# Altium project TX_v5.PrjPcb
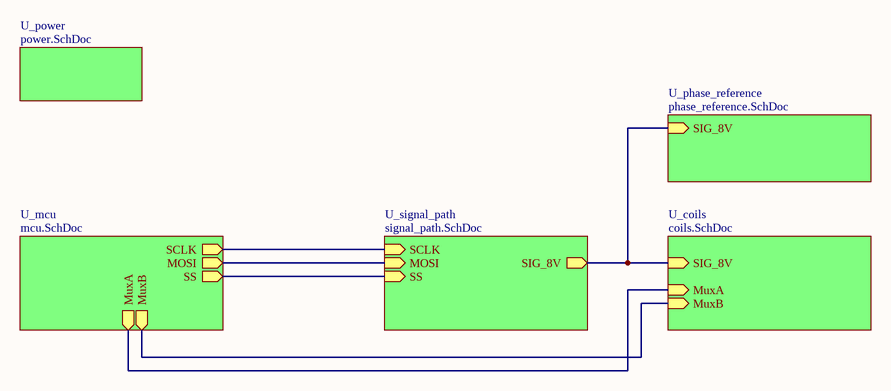
[diagram p0: TX_v5.SchDoc]
7 sheets, 94 parts. Net scope: hierarchical (ports join the sheet entries above them; power ports are global).
Board file: TX_v5.PcbDoc
Sheets:
  TX_v5.SchDoc
    U_power = power.SchDoc
    U_mcu = mcu.SchDoc
    U_signal_path = signal_path.SchDoc
    U_coils = coils.SchDoc
      ch1 = coil.SchDoc
      ch2 = coil.SchDoc
      ch3 = coil.SchDoc
    U_phase_reference = phase_reference.SchDoc

## Sheet TX_v5.SchDoc
size A

### Sub-sheets
U_coils = coils.SchDoc: MuxA (in), MuxB (in), SIG_8V (in)
U_mcu = mcu.SchDoc: SCLK (out), MuxB (out), MuxA (out), MOSI (out), SS (out)
U_phase_reference = phase_reference.SchDoc: SIG_8V (in)
U_power = power.SchDoc: no entries
U_signal_path = signal_path.SchDoc: SCLK (in), MOSI (in), SS (in), SIG_8V (out)

### Nets
MOSI: sheet U_mcu/MOSI, sheet U_signal_path/MOSI
MuxA: sheet U_mcu/MuxA, sheet U_coils/MuxA
MuxB: sheet U_mcu/MuxB, sheet U_coils/MuxB
SCLK: sheet U_mcu/SCLK, sheet U_signal_path/SCLK
SIG_8V: sheet U_signal_path/SIG_8V, sheet U_coils/SIG_8V, sheet U_phase_reference/SIG_8V
SS: sheet U_mcu/SS, sheet U_signal_path/SS

## Sheet power.SchDoc
size A
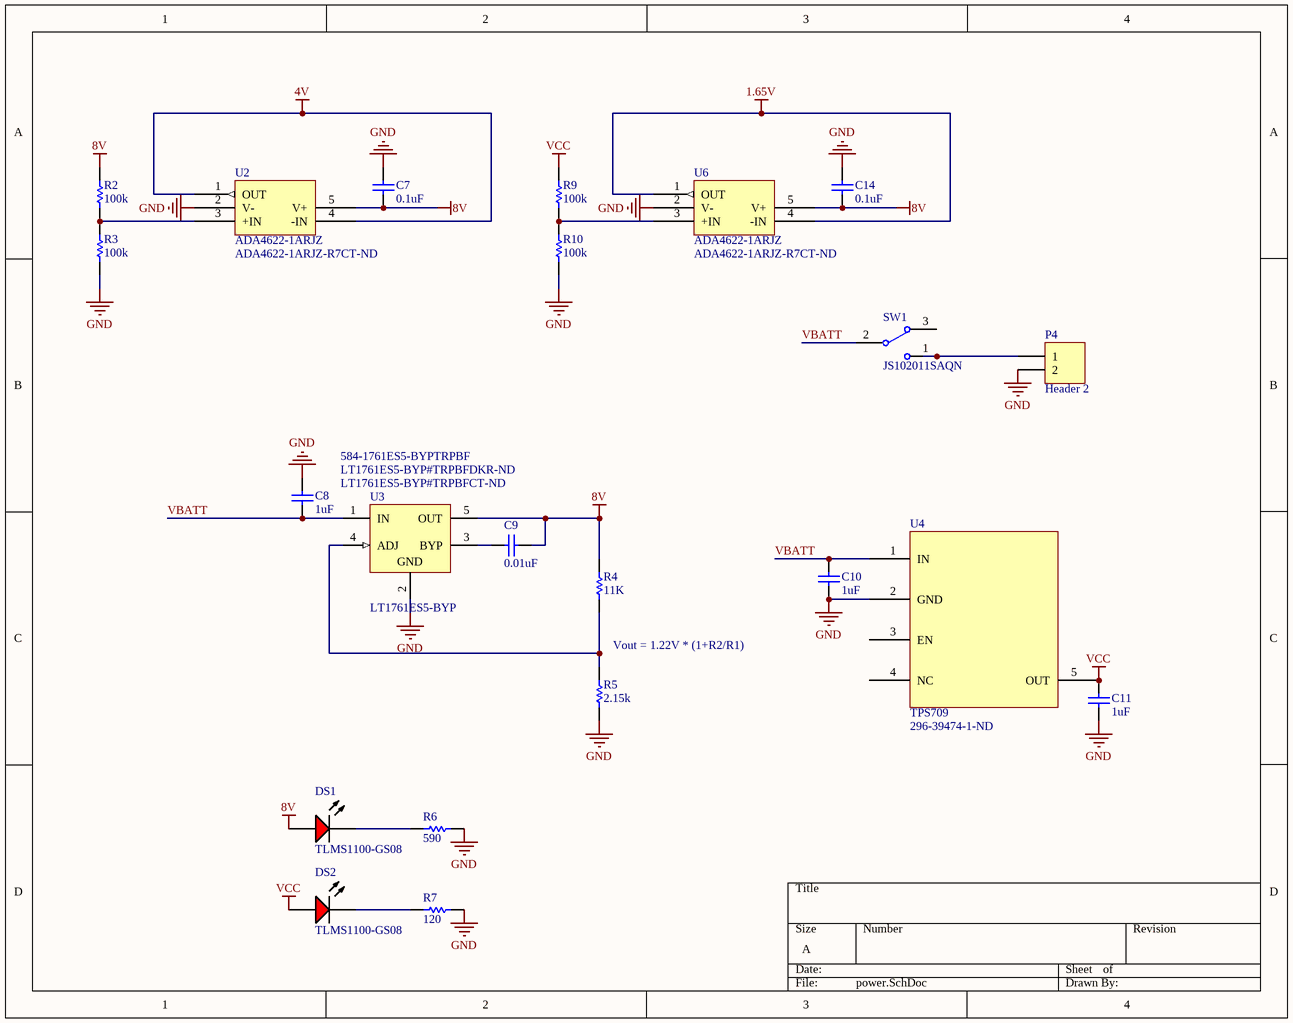
[diagram p1: power.SchDoc]

### Parts
C7  value 0.1uF  [0603]  (hidden comment: Cap)
C8  value 1uF  [0603]  (hidden comment: Cap)
C9  value 0.01uF  [0603]  (hidden comment: Cap)
C10  value 1uF  [0603]  (hidden comment: Cap)
C11  value 1uF  [0603]  (hidden comment: Cap)
C14  value 0.1uF  [0603]  (hidden comment: Cap)
DS1  TLMS1100-GS08  [VISH-TLMX1100_V]
DS2  TLMS1100-GS08  [VISH-TLMX1100_V]
P4  Header 2  [HDR1X2]
R2  value 100k  [0603]  (hidden comment: Res)
R3  value 100k  [0603]  (hidden comment: Res)
R4  value 11K  [0603]  (hidden comment: Res)
R5  value 2.15k  [0603]  (hidden comment: Res)
R6  value 590  [0603]  (hidden comment: Res)
R7  value 120  [0603]  (hidden comment: Res)
R9  value 100k  [0603]  (hidden comment: Res)
R10  value 100k  [0603]  (hidden comment: Res)
SW1  JS102011SAQN  [CKCP-JS102011SAQN-3_V]
U2  ADA4622-1ARJZ  Supplier Part Number 1: ADA4622-1ARJZ-R7CT-ND  [SOT95P280X145-5N]
U3  LT1761ES5-BYP  Supplier Part Number 1: LT1761ES5-BYP#TRPBFCT-ND  Supplier Part Number 2: LT1761ES5-BYP#TRPBFDKR-ND  Supplier Part Number 3: 584-1761ES5-BYPTRPBF  [LT-S5-5-TSOT-23_N]
U4  TPS709  Supplier Part Number 1: 296-39474-1-ND  [SOT95P280X145-5N]
U6  ADA4622-1ARJZ  Supplier Part Number 1: ADA4622-1ARJZ-R7CT-ND  [SOT95P280X145-5N]

### Nets
1.65V: U6.1(OUT) U6.4(-IN)
4V: U2.1(OUT) U2.4(-IN)
8V: C7.1 C9.1 C14.1 DS1.1(A) R2.2 R4.2 U2.5(V+) U3.5(OUT) U6.5(V+)
GND: C7.2 C8.2 C10.2 C11.2 C14.2 P4.2 R3.1 R5.1 R6.1 R7.1 R10.1 U2.2(V-) U3.2(GND) U4.2(GND) U6.2(V-)
VCC: C11.1 DS2.1(A) R9.2 U4.5(OUT)
VBATT: C8.1 C10.1 SW1.2 U3.1(IN) U4.1(IN)
NetC9_2: C9.2 U3.3(BYP)
NetDS1_2: DS1.2(K) R6.2
NetDS2_2: DS2.2(K) R7.2
NetP4_1: P4.1 SW1.1
NetR2_1: R2.1 R3.2 U2.3(+IN)
NetR4_1: R4.1 R5.2 U3.4(ADJ)
NetR9_1: R9.1 R10.2 U6.3(+IN)

Not connected (* = marked no-connect by the designer): SW1 3; U4 3(EN) 4(NC)

### Notes on the sheet
- Vout = 1.22V * (1+R2/R1)

### Library data of the parts
C7-C11 C14 = Cap: Ceramic Capacitor (Surface Mount); Manufacturer: Generic Ceramic Chip Cap (TBD); Digi-Key Part Number: *; Manufacturer Part Number: *; Note: *; Rating: *
DS1 DS2 = CMP-1666-00027-1: LED, RED, 2.1 V, -40 to 100 degC, 2-Pin SMD (0603), RoHS, Tape and Reel; Type (Capacitors): C0G; Resistance: 100000000000 Ohm; Capacitance: 12 pF; Voltage Rating: 50 V; Tolerance: 5%; Min Operating Temperature: -55degC; REACH SVHC: No SVHC; ComponentLink2Description: Datasheet; ComponentLink1URL: http://www.vishay.com/; Width: 0.8 mm; Package Quantity: 4000; PackageReference: TLMX1100; ComponentLink2URL: http://www.vishay.com/docs/83173/tlmb1100.pdf; Case/Package: 0603; Case Code (Metric): 1608; Packaging: Tape and Reel; Pins: 2; ComponentLink1Description: Manufacturer URL; Max Operating Temperature: 125degC; Height: 0.8 mm; Length: 1.6 mm; Mount: Surface Mount; PackageDescription: 2-Pin Surface Mount Device, Body 1.6 x 0.8 mm; DatasheetVersion: Rev. 2.7, 03/2016; Case Code (Imperial): 0603; Voltage Rating (DC): 50 V; RoHSCompliant: True; Radiation Hardening: No
P4 = Header 2: Header, 2-Pin; LatestRevisionDate: 17-Jul-2002; LatestRevisionNote: Re-released for DXP Platform.; Publisher: Altium Limited
R2-R7 R9 R10 = Res: Chip Resistor (Surface Mount); Manufacturer: Generic Chip Res (TBD); Manufacturer Part Number: *; Digi-Key Part Number: *; Rating: *
SW1 = CMP-2000-06501-1: Sub-Miniature Slide Switch, SPDT, -40 to 85 degC, 3-Pin SMD, RoHS, Tape and Reel; Manufacturer: C&K Components; Electrical Life: 15000Cycles; Actuator Color: Black; Body Orientation: RightAngle; Minimum Insulation Resistance: 100MOhm; Contact Rating @ Voltage: 0.3@6VDCA; Actuator Style: SideSlide; Maximum DC Voltage Rating: 6V; COO: US; Actuator Material: Nylon4/6; Dielectric Strength: 500VAC; Maximum Contact Resistance: 70mOhm; Base Material: N/A; Mounting Technology: SurfaceMount; Switch Configuration: N/A; Package Reference: SMT; Package Description: 3-Pin Surface Mount Device, Body 9 x 3.6 mm, Height 3.5 mm; Mounting: SurfaceMount,GullWing; Part No: JS102011SAQN; Dimension: 9x4.3mm; Type: Sub-Miniature; Product Weight: N/A; Seal Location: N/A; Family: JS; ECCN: EAR99; Supplier: C&KComponents; Seal Description: N/A; Contact Plating: Silver; Pole Throw Configuration: SPDT; Packaging: TapeandReel; Manufacturer URL: http://www.ckswitches.com/; Datasheet URL: https://datasheet.ciiva.com/1532/js-9dec14-1532400.pdf; Maximum AC Voltage Rating: N/A; Mechanical Life: N/A; HTS: 8536509050; Datasheet Version: 12/2014; Housing Material: Nylon4/6; Contact Material: CopperAlloy; RoHS: Yes; Operating Temperature: -40to85C
U2 U6 = ADA4622-1ARJZ: 30 V, 8 MHz, Low Bias Current, / Single-Supply, RRO, Precision Op Amps; ComponentLink1Description: Datasheet; ComponentLink1URL: http://www.analog.com/media/en/technical-documentation/data-sheets/ada4622-1-4622-2-4622-4.pdf; Supplier 1: Digi-Key
U3 = CMP-0476-01245-1: 100 mA, Low Noise, LDO Micropower Regulator, 1.8 to 20 V Vin, Adjustable Vout, 5-pin SOT23 (S5-5), -40 to 125 degC; Manufacturer: Linear Technology; Vout Max(V): 20; Isupply(mA): 0.02; PSRR(dB): 65; Vout Min(V): 1.22; Iout(mA): 100; Shutdown Current(uA): 1; Discrete Pass Element: no; Vin Min(V): 1.8; Output Voltage: Adj; Dropout Voltage(V): 0.3; PackageDescription: 5-Pin Plastic TSOT-23, Body 1.63 x 2.90 mm, Pitch 0.95 mm; ComponentLink2URL: http://cds.linear.com/docs/en/datasheet/1761sff.pdf; Code_JEDEC: MO-193; DatasheetVersion: Rev. F; Mounting Technology: Surface Mount; PackageReference: S5-5; ComponentLink3Description: Package Specification; ComponentLink2Description: Datasheet; ComponentLink1Description: Manufacturer URL; RoHS: FALSE; Number of Outputs: 1; Noise(uV): 20; Vin Max(V): 20; ComponentLink1URL: http://www.linear.com/; PackageVersion: Jun-10; ComponentLink3URL: http://cds.linear.com/docs/en/packaging/SOT_5_05-08-1635.pdf; PartNumber: LT1761ES5-BYP; Supplier 1: Digi-Key; Supplier 2: Digi-Key; Supplier 3: Mouser
U4 = TPS70933: 3.3V Ultra low power Voltage Regulator; Supplier 1: Digi-Key

## Sheet mcu.SchDoc
size A
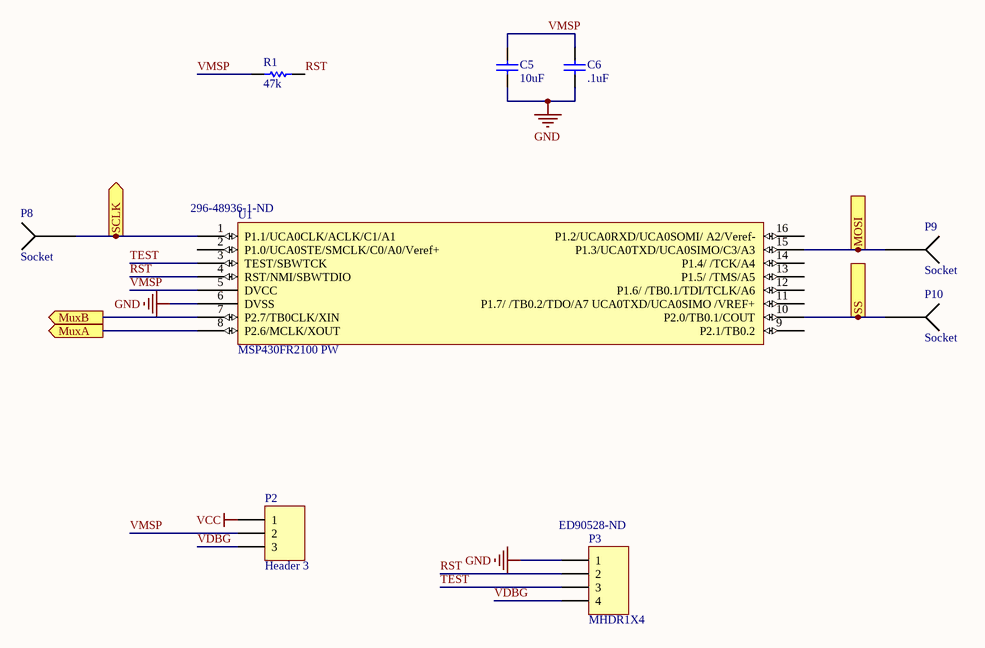
[diagram p2: mcu.SchDoc]

### Parts
C5  value 10uF  [0603]  (hidden comment: Cap)
C6  value .1uF  [0603]  (hidden comment: Cap)
P2  Header 3  [HDR1X3]
P3  MHDR1X4  Supplier Part Number 1: ED90528-ND  [MHDR1X4]
P8  Socket  [socket]
P9  Socket  [socket]
P10  Socket  [socket]
R1  value 47k  [0603]  (hidden comment: Res)
U1  MSP430FR2100 PW  Supplier Part Number 1: 296-48936-1-ND  [TSOP65P640X120-16N]

### Ports
MOSI (out), MuxA (out), MuxB (out), SCLK (out), SS (out)

### Nets
GND: C5.1 C6.1 P3.1 U1.6(DVSS)
VCC: P2.1
MOSI: P9.0 U1.15(P1.3/UCA0TXD/UCA0SIMO/C3/A3) ; port MOSI
MuxA: U1.8(P2.6/MCLK/XOUT) ; port MuxA
MuxB: U1.7(P2.7/TB0CLK/XIN) ; port MuxB
RST: P3.2 R1.2 U1.4(RST/NMI/SBWTDIO)
SCLK: P8.0 U1.1(P1.1/UCA0CLK/ACLK/C1/A1) ; port SCLK
SS: P10.0 U1.10(P2.0/TB0.1/COUT) ; port SS
TEST: P3.3 U1.3(TEST/SBWTCK)
VDBG: P2.3 P3.4
VMSP: C5.2 C6.2 P2.2 R1.1 U1.5(DVCC)

Not connected (* = marked no-connect by the designer): U1 2(P1.0/UCA0STE/SMCLK/C0/A0/Veref+) 9(P2.1/TB0.2) 11(P1.7/_/TB0.2/TDO/A7_UCA0TXD/UCA0SIMO_/VREF+) 12(P1.6/_/TB0.1/TDI/TCLK/A6) 13(P1.5/_/TMS/A5) 14(P1.4/_/TCK/A4) 16(P1.2/UCA0RXD/UCA0SOMI/_A2/Veref-)

### Library data of the parts
C5 C6 = Cap: as C7 on sheet power; Digi-Key Part Number: *; Manufacturer Part Number: *; Note: *; Rating: *
P2 = Header 3: Header, 3-Pin; LatestRevisionDate: 17-Jul-2002; LatestRevisionNote: Re-released for DXP Platform.; Publisher: Altium Limited
P3 = MHDR1X4: Header, 4-Pin; LatestRevisionDate: 17-Jul-2002; LatestRevisionNote: Re-released for DXP Platform.; Publisher: Altium Limited; Supplier 1: Digi-Key
R1 = Res: as R2 on sheet power; Manufacturer Part Number: *; Digi-Key Part Number: *; Rating: *
U1 = MSP430FR2100 PW: ComponentLink1Description: Datasheet; ComponentLink1URL: http://www.ti.com/lit/ds/symlink/msp430fr2100.pdf; ComponentLink2Description: DigiKey; ComponentLink2URL: https://www.digikey.com/product-detail/en/texas-instruments/MSP430FR2100IPW16R/296-48936-1-ND/8634999; Supplier 1: Digi-Key

## Sheet signal_path.SchDoc: Signal Path
size A
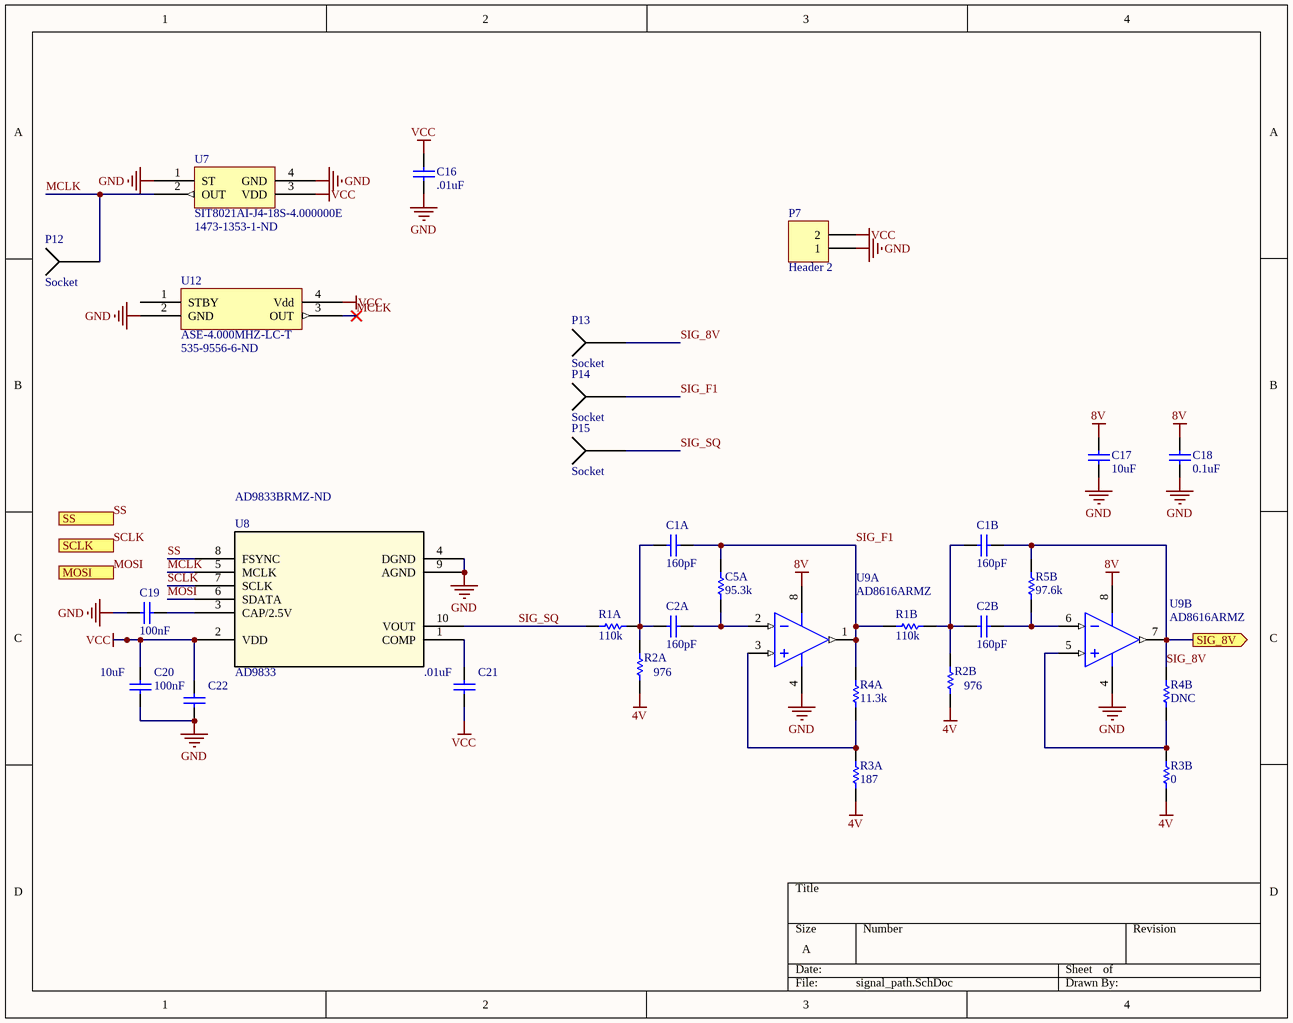
[diagram p3: signal_path.SchDoc]

### Parts
C1A  value 160pF  [0603]  (hidden comment: Cap)
C1B  value 160pF  [0603]  (hidden comment: Cap)
C2A  value 160pF  [0603]  (hidden comment: Cap)
C2B  value 160pF  [0603]  (hidden comment: Cap)
C5A  value 95.3k  [0603]  (hidden comment: Res)
C16  value .01uF  [0603]  (hidden comment: Cap)
C17  value 10uF  [0603]  (hidden comment: Cap)
C18  value 0.1uF  [0603]  (hidden comment: Cap)
C19  value 100nF  [0603]  (hidden comment: Cap)
C20  value 10uF  [0603]  (hidden comment: Cap)
C21  value .01uF  [0603]  (hidden comment: Cap)
C22  value 100nF  [0603]  (hidden comment: Cap)
P7  Header 2  [HDR1X2]
P12  Socket  [socket]
P13  Socket  [socket]
P14  Socket  [socket]
P15  Socket  [socket]
R1A  value 110k  [0603]  (hidden comment: Res)
R1B  value 110k  [0603]  (hidden comment: Res)
R2A  value 976  [0603]  (hidden comment: Res)
R2B  value 976  [0603]  (hidden comment: Res)
R3A  value 187  [0603]  (hidden comment: Res)
R3B  value 0  [0603]  (hidden comment: Res)
R4A  value 11.3k  [0603]  (hidden comment: Res)
R4B  value DNC  [0603]  (hidden comment: Res)
R5B  value 97.6k  [0603]  (hidden comment: Res)
U7  SIT8021AI-J4-18S-4.000000E  Supplier Part Number 1: 1473-1353-1-ND  [SiT8021 - BGA4C100P2X2_154X84X60]
U8  AD9833  Supplier Part Number 1: AD9833BRMZ-ND  [MSOP-10]
U9  AD8616ARMZ  [ADI-RM-8_M]  (parts A,B of 2)
U12  ASE-4.000MHZ-LC-T  Supplier Part Number 1: 535-9556-6-ND  [DFN165P250X120-4N]

### Ports
MOSI (in), SCLK (in), SIG_8V (out), SS (in)

### Nets
4V: R2A.1 R2B.1 R3A.1 R3B.1
8V: C17.1 C18.1 U9.8(+V)
GND: C16.2 C17.2 C18.2 C19.1 C20.2 C22.2 P7.1 U7.1(ST) U7.4(GND) U8.4(DGND) U8.9(AGND) U9.4(-V) U12.2(GND)
VCC: C16.1 C20.1 C21.2 C22.1 P7.2 U7.3(VDD) U8.2(VDD) U12.4(Vdd)
MCLK: P12.0 U7.2(OUT) U8.5(MCLK) U12.3(OUT)
MOSI: U8.6(SDATA) ; port MOSI
SCLK: U8.7(SCLK) ; port SCLK
SIG_8V: C1B.2 P13.0 R4B.2 R5B.2 U9.7(OUT_B) ; port SIG_8V
SIG_F1: C1A.2 C5A.2 P14.0 R1B.1 R4A.2 U9.1(OUT_A)
SIG_SQ: P15.0 R1A.1 U8.10(VOUT)
SS: U8.8(FSYNC) ; port SS
NetC1A_1: C1A.1 C2A.1 R1A.2 R2A.2
NetC1B_1: C1B.1 C2B.1 R1B.2 R2B.2
NetC2A_2: C2A.2 C5A.1 U9.2(-IN_A)
NetC2B_2: C2B.2 R5B.1 U9.6(-IN_B)
NetC19_2: C19.2 U8.3(CAP/2.5V)
NetC21_1: C21.1 U8.1(COMP)
NetR3A_2: R3A.2 R4A.1 U9.3(+IN_A)
NetR3B_2: R3B.2 R4B.1 U9.5(+IN_B)

Not connected (* = marked no-connect by the designer): U12 1(STBY)

### Library data of the parts
C1A C1B C2A C2B C16-C22 = Cap: as C7 on sheet power; Digi-Key Part Number: *; Manufacturer Part Number: *; Note: *; Rating: *
C5A R1A R1B R2A R2B R3A R3B R4A R4B R5B = Res: as R2 on sheet power; Manufacturer Part Number: *; Digi-Key Part Number: *; Rating: *
P7 = Header 2: Header, 2-Pin; LatestRevisionDate: 17-Jul-2002; LatestRevisionNote: Re-released for DXP Platform.; Publisher: Altium Limited
U7 = SIT8021AI-J4-18S-4.000000E: 4 MHz low power oscillator; Supplier 1: Digi-Key
U8 = AD9833: MSOP-10; Supplier 1: Digi-Key
U9 = CMP-0384-01709-1: Double Channel Wide Bandwidth Operational Amplifier, 24 MHz BW, 12 V/us SR, Industrial, 8-pin SOP (RM-8), Tube; Generic Part Number: AD8616; Manufacturer: Analog Devices; Amplifiers Per Package: 2; Small Signal Bandwidth: 24MHz; Input Offset Voltage: 23uV; Input Bias Current: 200fA; V Span Min: 2.7V; Iq/Amp: 2mA; Slew Rate: 12V/us; V Span Max: 6V; PackageDescription: 8-Pin Mini Small Outline Package, Body 3 x 3 mm, Pitch 0.65 mm; PartNumber: AD8616ARMZ; ComponentLink2URL: http://www.analog.com/static/imported-files/data_sheets/AD8615_8616_8618.pdf; ComponentLink3URL: http://www.analog.com/static/imported-files/packages/PKG_PDF/MSOP%28RM%29/RM_8.pdf; PackageReference: RM-8; Mounting Technology: Surface Mount; Code_JEDEC: MO-187-AA; ComponentLink1Description: Manufacturer URL; ComponentLink2Description: Datasheet; ComponentLink3Description: Package Specification; ComponentLink1URL: http://www.analog.com/en/index.html; DatasheetVersion: Rev. E; PartId: 1
U12 = ASE-4.000MHZ-LC-T: 4 MHz SMD Oscillator; Supplier 1: Digi-Key

## Sheet coils.SchDoc
size A
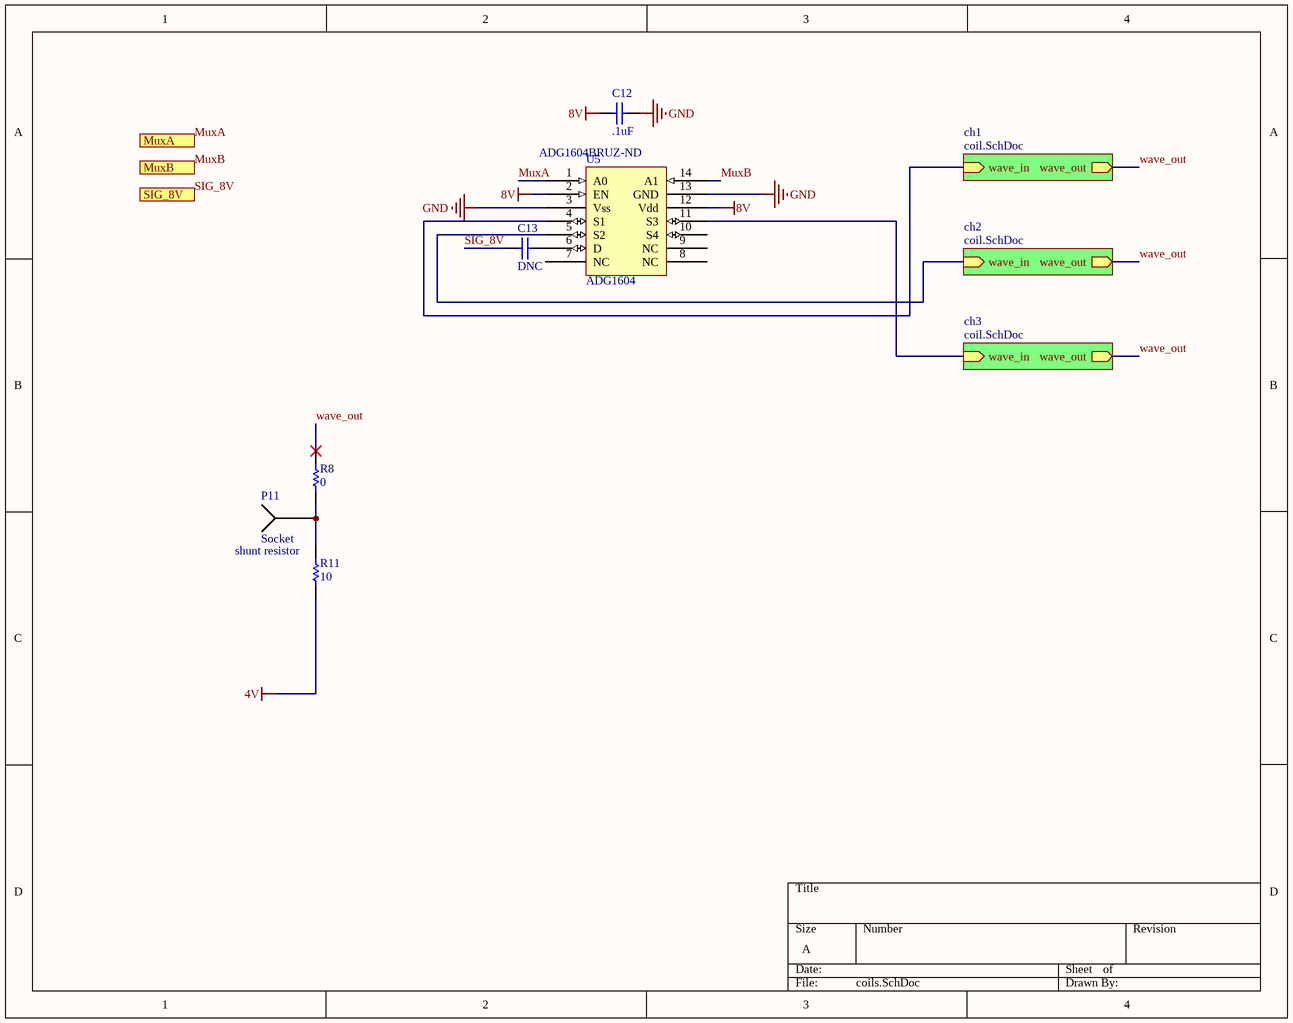
[diagram p4: coils.SchDoc]

### Parts
C12  value .1uF  [0603]  (hidden comment: Cap)
C13  value DNC  [0603]  (hidden comment: Cap)
P11  Socket  [socket]
R8  value 0  [0603]  (hidden comment: Res)
R11  value 10  [0603]  (hidden comment: Res)
U5  ADG1604  Supplier Part Number 1: ADG1604BRUZ-ND  [TSSOP-14]

### Sub-sheets
ch1 = coil.SchDoc: wave_in (in), wave_out (out)
ch2 = coil.SchDoc: wave_in (in), wave_out (out)
ch3 = coil.SchDoc: wave_in (in), wave_out (out)

### Ports
MuxA (in), MuxB (in), SIG_8V (in)

### Nets
4V: R11.1
8V: C12.1 U5.2(EN) U5.12(Vdd)
GND: C12.2 U5.3(Vss) U5.13(GND)
MuxA: U5.1(A0) ; port MuxA
MuxB: U5.14(A1) ; port MuxB
SIG_8V: C13.1 ; port SIG_8V
wave_out: R8.2 ; sheet ch1/wave_out, sheet ch2/wave_out, sheet ch3/wave_out
NetC1_ch1_2: U5.4(S1) ; sheet ch1/wave_in
NetC1_ch2_2: U5.5(S2) ; sheet ch2/wave_in
NetC1_ch3_2: U5.11(S3) ; sheet ch3/wave_in
NetC13_2: C13.2 U5.6(D)
NetP11_0: P11.0 R8.1 R11.2

Not connected (* = marked no-connect by the designer): U5 7(NC) 8(NC) 9(NC) 10(S4)

### Notes on the sheet
- (near R11) shunt resistor

### Library data of the parts
C12 C13 = Cap: as C7 on sheet power; Digi-Key Part Number: *; Manufacturer Part Number: *; Note: *; Rating: *
R8 R11 = Res: as R2 on sheet power; Manufacturer Part Number: *; Digi-Key Part Number: *; Rating: *
U5 = ADG1604: Supplier 1: Digi-Key

## Sheet coil.SchDoc
size A
Used 3 times, as channels U_coils/ch1, U_coils/ch2, U_coils/ch3. Parts and nets are listed once, with the designators drawn on the sheet.
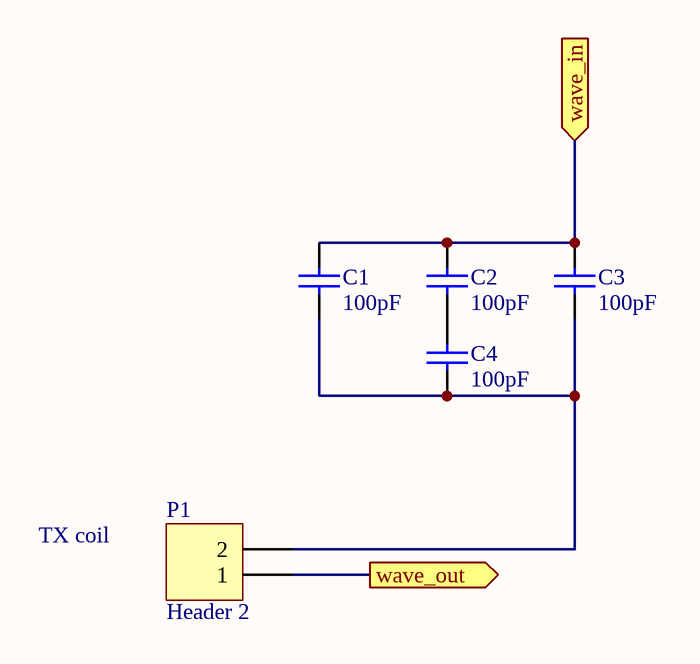
[diagram p5: coil.SchDoc]

### Parts
C1  value 100pF  [0603]  (hidden comment: Cap)
C2  value 100pF  [0603]  (hidden comment: Cap)
C3  value 100pF  [0603]  (hidden comment: Cap)
C4  value 100pF  [0603]  (hidden comment: Cap)
P1  Header 2  [HDR1X2]

### Ports
wave_in (in), wave_out (out)

### Nets
wave_in: C1.2 C2.2 C3.2 ; port wave_in
wave_out: P1.1 ; port wave_out
NetC1_1: C1.1 C3.1 C4.1 P1.2
NetC2_1: C2.1 C4.2

### Channels
U_coils/ch1: designators end in _ch1; ports wave_in=NetC1_ch1_2 wave_out=wave_out
U_coils/ch2: designators end in _ch2; ports wave_in=NetC1_ch2_2 wave_out=wave_out
U_coils/ch3: designators end in _ch3; ports wave_in=NetC1_ch3_2 wave_out=wave_out

### Notes on the sheet
- TX coil

### Library data of the parts
C1-C4 = Cap: as C7 on sheet power; Digi-Key Part Number: *; Manufacturer Part Number: *; Note: *; Rating: *
P1 = Header 2: Header, 2-Pin; LatestRevisionDate: 17-Jul-2002; LatestRevisionNote: Re-released for DXP Platform.; Publisher: Altium Limited

## Sheet phase_reference.SchDoc
size A
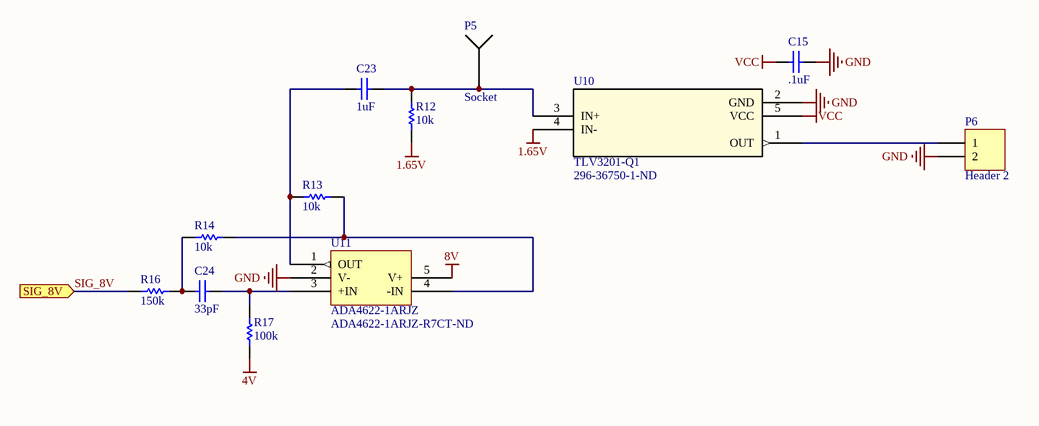
[diagram p6: phase_reference.SchDoc]

### Parts
C15  value .1uF  [0603]  (hidden comment: Cap)
C23  value 1uF  [0603]  (hidden comment: Cap)
C24  value 33pF  [0603]  (hidden comment: Cap)
P5  Socket  [socket]
P6  Header 2  [HDR1X2]
R12  value 10k  [0603]  (hidden comment: Res)
R13  value 10k  [0603]  (hidden comment: Res)
R14  value 10k  [0603]  (hidden comment: Res)
R16  value 150k  [0603]  (hidden comment: Res)
R17  value 100k  [0603]  (hidden comment: Res)
U10  TLV3201-Q1  Supplier Part Number 1: 296-36750-1-ND  [SOT95P280X145-5N]
U11  ADA4622-1ARJZ  Supplier Part Number 1: ADA4622-1ARJZ-R7CT-ND  [SOT95P280X145-5N]

### Ports
SIG_8V (in)

### Nets
1.65V: R12.1 U10.4(IN-)
4V: R17.1
8V: U11.5(V+)
GND: C15.2 P6.2 U10.2(GND) U11.2(V-)
VCC: C15.1 U10.5(VCC)
SIG_8V: R16.2 ; port SIG_8V
NetC23_1: C23.1 P5.0 R12.2 U10.3(IN+)
NetC23_2: C23.2 R13.2 U11.1(OUT)
NetC24_1: C24.1 R17.2 U11.3(+IN)
NetC24_2: C24.2 R14.2 R16.1
NetP6_1: P6.1 U10.1(OUT)
NetR13_1: R13.1 R14.1 U11.4(-IN)

### Library data of the parts
C15 C23 C24 = Cap: as C7 on sheet power; Digi-Key Part Number: *; Manufacturer Part Number: *; Note: *; Rating: *
P6 = Header 2: Header, 2-Pin; LatestRevisionDate: 17-Jul-2002; LatestRevisionNote: Re-released for DXP Platform.; Publisher: Altium Limited
R12-R14 R16 R17 = Res: as R2 on sheet power; Manufacturer Part Number: *; Digi-Key Part Number: *; Rating: *
U10 = TLV3201-Q1: 40-ns, Micropower Comparator; Supplier 1: Digi-Key
U11 = ADA4622-1ARJZ: as U2 on sheet power; ComponentLink1Description: Datasheet; ComponentLink1URL: http://www.analog.com/media/en/technical-documentation/data-sheets/ada4622-1-4622-2-4622-4.pdf; Supplier 1: Digi-Key

## Nets that join several sheets
1.65V: power (U6.1 U6.4), phase_reference (R12.1 U10.4)
4V: power (U2.1 U2.4), signal_path (R2A.1 R2B.1 R3A.1 R3B.1), coils (R11.1), phase_reference (R17.1)
8V: power (9 pins), signal_path (C17.1 C18.1 U9.8), coils (C12.1 U5.2 U5.12), phase_reference (U11.5)
GND: power (15 pins), mcu (C5.1 C6.1 P3.1 U1.6), signal_path (13 pins), coils (C12.2 U5.3 U5.13), phase_reference (C15.2 P6.2 U10.2 U11.2)
VCC: power (C11.1 DS2.1 R9.2 U4.5), mcu (P2.1), signal_path (8 pins), phase_reference (C15.1 U10.5)
MOSI: mcu (P9.0 U1.15), signal_path (U8.6)
MuxA: mcu (U1.8), coils (U5.1)
MuxB: mcu (U1.7), coils (U5.14)
NetC1_ch1_2: coils (U5.4), U_coils/ch1 (C1_ch1.2 C2_ch1.2 C3_ch1.2)
NetC1_ch2_2: coils (U5.5), U_coils/ch2 (C1_ch2.2 C2_ch2.2 C3_ch2.2)
NetC1_ch3_2: coils (U5.11), U_coils/ch3 (C1_ch3.2 C2_ch3.2 C3_ch3.2)
SCLK: mcu (P8.0 U1.1), signal_path (U8.7)
SIG_8V: signal_path (5 pins), coils (C13.1), phase_reference (R16.2)
SS: mcu (P10.0 U1.10), signal_path (U8.8)
wave_out: coils (R8.2), U_coils/ch1 (P1_ch1.1), U_coils/ch2 (P1_ch2.1), U_coils/ch3 (P1_ch3.1)